# Altium schematic sheet test_Zoli.SchDoc
size A4
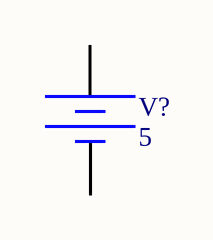
[diagram p0: test_Zoli.SchDoc]

## Parts
V?  DC Magnitude: 5  (hidden comment: Constant Voltage Source)

## Nets

Not connected (* = marked no-connect by the designer): V? 1 2

## Library data of the parts
V? = Battery: SimulationGenericComponent: True